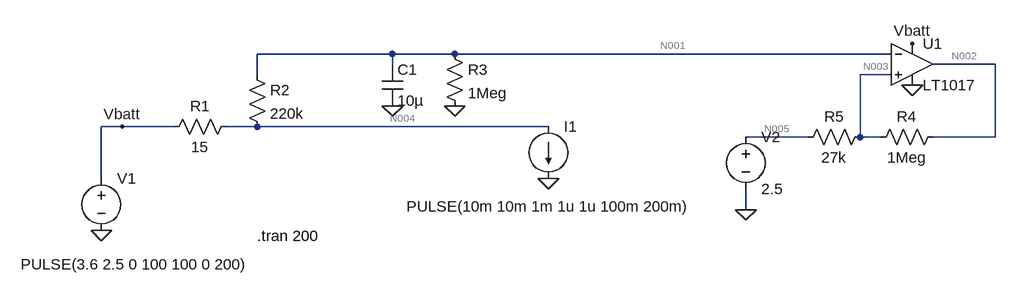
[diagram p0: schematic Draft2.asc]
Draft2.asc, the LTspice schematic file:
Version 4
SHEET 1 1476 680
WIRE 544 -48 336 -48
WIRE 640 -48 544 -48
WIRE 1312 -48 640 -48
WIRE 544 -32 544 -48
WIRE 1472 -32 1376 -32
WIRE 336 -16 336 -48
WIRE 1312 -16 1264 -16
WIRE 128 64 96 64
WIRE 208 64 128 64
WIRE 336 64 288 64
WIRE 784 64 336 64
WIRE 1184 80 1088 80
WIRE 1264 80 1264 -16
WIRE 1296 80 1264 80
WIRE 1472 80 1472 -32
WIRE 1472 80 1376 80
WIRE 96 144 96 64
WIRE 1088 192 1088 160
FLAG 96 224 0
FLAG 784 144 0
FLAG 544 32 0
FLAG 640 32 0
FLAG 1344 0 0
FLAG 128 64 Vbatt
FLAG 1344 -64 Vbatt
FLAG 1088 192 0
SYMBOL voltage 96 128 R0
WINDOW 3 -124 148 Left 2
WINDOW 123 0 0 Left 0
WINDOW 39 0 0 Left 0
SYMATTR InstName V1
SYMATTR Value PULSE(3.6 2.5 0 100 100 0 200)
SYMBOL res 304 48 R90
WINDOW 0 0 56 VBottom 2
WINDOW 3 32 56 VTop 2
SYMATTR InstName R1
SYMATTR Value 15
SYMBOL current 784 64 R0
WINDOW 3 -218 123 Left 2
WINDOW 123 0 0 Left 0
WINDOW 39 0 0 Left 0
SYMATTR InstName I1
SYMATTR Value PULSE(10m 10m 1m 1u 1u 100m 200m)
SYMBOL res 320 -32 R0
SYMATTR InstName R2
SYMATTR Value 220k
SYMBOL cap 528 -32 R0
SYMATTR InstName C1
SYMATTR Value 10µ
SYMBOL res 624 -64 R0
SYMATTR InstName R3
SYMATTR Value 1Meg
SYMBOL Comparators\\LT1017 1344 -32 R0
SYMATTR InstName U1
SYMBOL res 1392 64 R90
WINDOW 0 0 56 VBottom 2
WINDOW 3 32 56 VTop 2
SYMATTR InstName R4
SYMATTR Value 1Meg
SYMBOL res 1280 64 R90
WINDOW 0 0 56 VBottom 2
WINDOW 3 32 56 VTop 2
SYMATTR InstName R5
SYMATTR Value 27k
SYMBOL voltage 1088 64 R0
WINDOW 123 0 0 Left 0
WINDOW 39 0 0 Left 0
SYMATTR InstName V2
SYMATTR Value 2.5
TEXT 336 232 Left 2 !.tran 200

The netlist it stands for:
* Draft2.asc
V1 Vbatt 0 PULSE(3.6 2.5 0 100 100 0 200)
R1 N004 Vbatt 15
I1 N004 0 PULSE(10m 10m 1m 1u 1u 100m 200m)
R2 N001 N004 220k
C1 N001 0 10µ
R3 N001 0 1Meg
XU1 N003 N001 Vbatt 0 N002 LT1017  ; pins In+ In- V+ V- OUT
R4 N002 N003 1Meg
R5 N003 N005 27k
V2 N005 0 2.5
.tran 200
.backanno
.end

* Results of the author's LTspice run, read from the files saved beside the schematic
* Operating Point, zero values left out:
*   V(vbatt) = 3.6 V
*   V(n004) = 3.45 V
*   V(n001) = 2.827 V
*   V(n002) = 48.42 mV
*   V(n003) = 2.436 V
*   V(n005) = 2.5 V
*   I(I1) = 10 mA
*   I(R5) = -2.387 µA
*   I(R4) = -2.387 µA
*   I(R3) = 2.827 µA
*   I(R2) = -2.833 µA
*   I(R1) = -10 mA
*   I(V2) = -2.387 µA
*   I(V1) = -10.11 mA
*   Ix(u1:1) = 100 pA
*   Ix(u1:2) = 6.1 nA
*   Ix(u1:3) = 105.3 µA
*   Ix(u1:4) = -107.7 µA
*   Ix(u1:5) = 2.387 µA
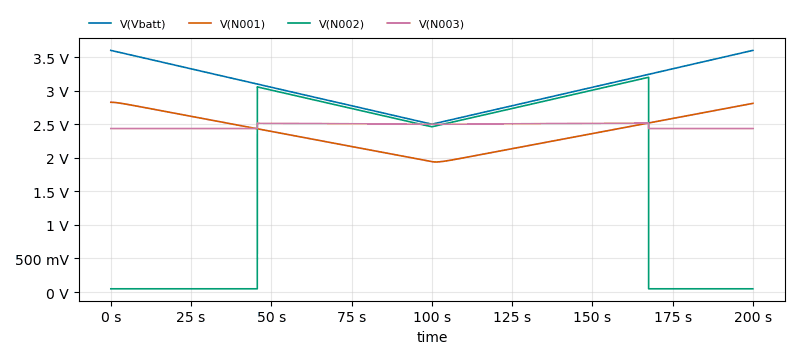
[diagram p1: Transient Analysis of Draft2.asc, plotted from the saved traces]
* Transient Analysis, 1 run:
*   V(Vbatt): min 2.5 V, max 3.6 V, average 3.05 V, rms 3.067 V, last 3.6 V
*   V(N001): min 1.938 V, max 2.827 V, average 2.377 V, rms 2.391 V, last 2.81 V
*   V(N002): min 48.42 mV, max 3.199 V, average 1.724 V, rms 2.19 V, last 48.42 mV
*   V(N003): min 2.435 V, max 2.518 V, average 2.479 V, rms 2.48 V, last 2.436 V